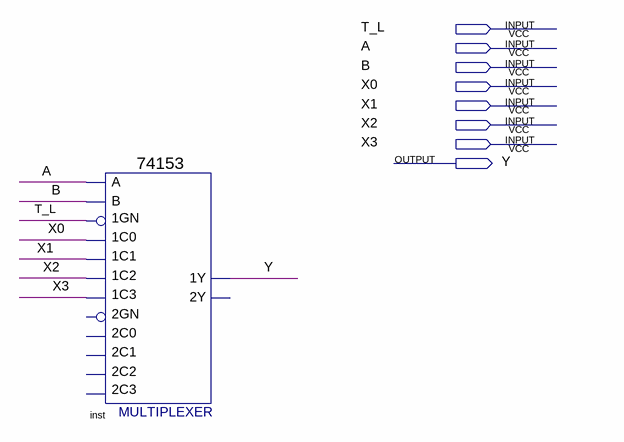
[diagram p0: schematic sheet]
// Quartus schematic lab2_MUX_TEST.bdf as structural Verilog: 1 symbols, 8 pins
module lab2_MUX_TEST (
  input  T_L,
  input  A,
  input  B,
  input  X0,
  input  X1,
  input  X2,
  input  X3,
  output Y
);

  \74153  inst (
    .\1C1 (X1), .\1GN (T_L), .\1C0 (X0), .\1C2 (X2), .\1C3 (X3), .B(B), .A(A), .\1Y (Y));  // open: 2C0, 2GN, 2C2, 2C1, 2C3, 2Y
endmodule
